# EAGLE schematic flash-programmer-v11 (EAGLE 6.4)
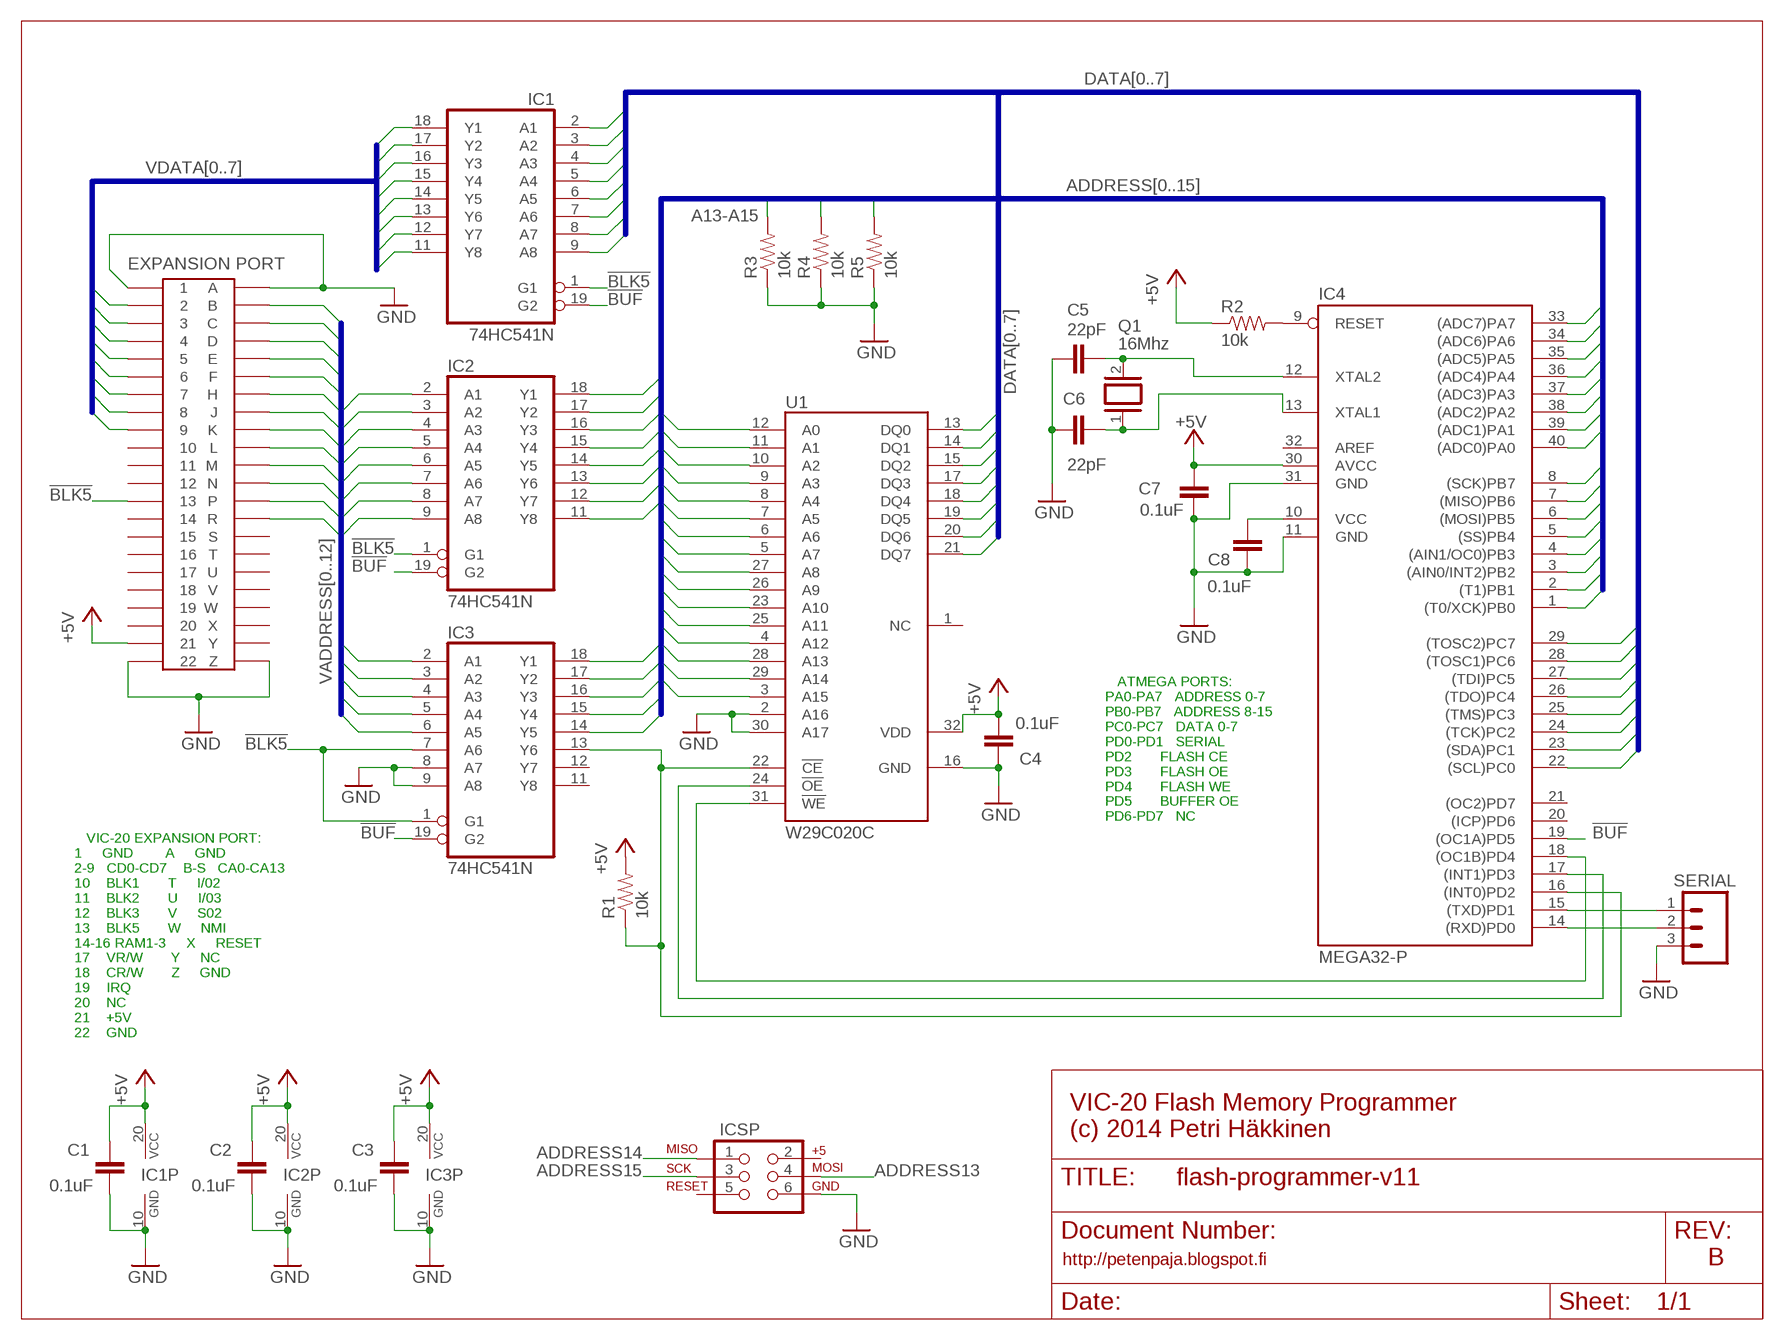
[diagram p0: schematic, sheet 1]

## Parts
C1  0.1uF  CAPPTH  [CAP-PTH-SMALL]
C2  0.1uF  CAPPTH  [CAP-PTH-SMALL]
C3  0.1uF  CAPPTH  [CAP-PTH-SMALL]
C4  0.1uF  CAPPTH  [CAP-PTH-SMALL]
C5  22pF  CAPPTH  [CAP-PTH-SMALL]
C6  22pF  CAPPTH  [CAP-PTH-SMALL]
C7  0.1uF  CAPPTH  [CAP-PTH-SMALL]
C8  0.1uF  CAPPTH  [CAP-PTH-SMALL]
IC1  74HC541N  [DIL20]
IC2  74HC541N  [DIL20]
IC3  74HC541N  [DIL20]
IC4  MEGA32-P  [DIL40]
ICSP  AVR_SPI_PRG_6PTH  [2X3]
P1  44PINEDGE  [44PINEDGE]
Q1  16Mhz  XTAL  [Q]
R1  10k  RESISTORPTH-1/4W  [AXIAL-0.4]
R2  10k  RESISTORPTH-1/4W  [AXIAL-0.4]
R3  10k  RESISTORPTH-1/4W  [AXIAL-0.4]
R4  10k  RESISTORPTH-1/4W  [AXIAL-0.4]
R5  10k  RESISTORPTH-1/4W  [AXIAL-0.4]
SERIAL  M03PTH  [1X03]
U1  W29C020C  [DIL32]

## Nets
!BLK5: IC1.1(G1) IC2.1(G1) IC3.1(G1) IC3.7(A6) P1.13
!BUF: IC1.19(G2) IC2.19(G2) IC3.19(G2) IC4.19((OC1A)PD5)
+5V: C1.1 C2.1 C3.1 C7.1 IC1.20(VCC) IC2.20(VCC) IC3.20(VCC) IC4.30(AVCC) R1.P$2
ADDRESS0: IC2.18(Y1) IC4.40((ADC0)PA0) U1.12(A0)
ADDRESS1: IC2.17(Y2) IC4.39((ADC1)PA1) U1.11(A1)
ADDRESS2: IC2.16(Y3) IC4.38((ADC2)PA2) U1.10(A2)
ADDRESS3: IC2.15(Y4) IC4.37((ADC3)PA3) U1.9(A3)
ADDRESS4: IC2.14(Y5) IC4.36((ADC4)PA4) U1.8(A4)
ADDRESS5: IC2.13(Y6) IC4.35((ADC5)PA5) U1.7(A5)
ADDRESS6: IC2.12(Y7) IC4.34((ADC6)PA6) U1.6(A6)
ADDRESS7: IC2.11(Y8) IC4.33((ADC7)PA7) U1.5(A7)
ADDRESS8: IC3.18(Y1) IC4.1((T0/XCK)PB0) U1.27(A8)
ADDRESS9: IC3.17(Y2) IC4.2((T1)PB1) U1.26(A9)
ADDRESS10: IC3.16(Y3) IC4.3((AIN0/INT2)PB2) U1.23(A10)
ADDRESS11: IC3.15(Y4) IC4.4((AIN1/OC0)PB3) U1.25(A11)
ADDRESS12: IC3.14(Y5) IC4.5((SS)PB4) U1.4(A12)
ADDRESS13: IC4.6((MOSI)PB5) ICSP.4 R3.P$2 U1.28(A13)
ADDRESS14: IC4.7((MISO)PB6) ICSP.1 R4.P$2 U1.29(A14)
ADDRESS15: IC4.8((SCK)PB7) ICSP.3 R5.P$2 U1.3(A15)
DATA0: IC1.2(A1) IC4.22((SCL)PC0) U1.13(DQ0)
DATA1: IC1.3(A2) IC4.23((SDA)PC1) U1.14(DQ1)
DATA2: IC1.4(A3) IC4.24((TCK)PC2) U1.15(DQ2)
DATA3: IC1.5(A4) IC4.25((TMS)PC3) U1.17(DQ3)
DATA4: IC1.6(A5) IC4.26((TDO)PC4) U1.18(DQ4)
DATA5: IC1.7(A6) IC4.27((TDI)PC5) U1.19(DQ5)
DATA6: IC1.8(A7) IC4.28((TOSC1)PC6) U1.20(DQ6)
DATA7: IC1.9(A8) IC4.29((TOSC2)PC7) U1.21(DQ7)
GND: C1.2 C2.2 C3.2 C4.1 C5.1 C6.1 C7.2 C8.1 IC1.10(GND) IC2.10(GND) IC3.8(A7) IC3.9(A8) IC3.10(GND) IC4.11(GND) IC4.31(GND) ICSP.6 P1.1 P1.22 P1.A P1.Z R3.P$1 R4.P$1 R5.P$1 SERIAL.3 U1.2(A16) U1.16(GND) U1.30(A17)
N$1: C5.2 IC4.12(XTAL2) Q1.2
N$2: C8.2 IC4.10(VCC)
N$3: IC4.9(RESET) R2.P$2
N$5: IC4.18((OC1B)PD4) U1.31(!WE)
N$6: IC4.15((TXD)PD1) SERIAL.1
N$7: IC4.17((INT1)PD3) U1.24(!OE)
N$8: IC3.13(Y6) IC4.16((INT0)PD2) R1.P$1 U1.22(!CE)
N$9: IC4.14((RXD)PD0) SERIAL.2
N$10: C6.2 IC4.13(XTAL1) Q1.1
VADDRESS0: IC2.2(A1) P1.B
VADDRESS1: IC2.3(A2) P1.C
VADDRESS2: IC2.4(A3) P1.D
VADDRESS3: IC2.5(A4) P1.E
VADDRESS4: IC2.6(A5) P1.F
VADDRESS5: IC2.7(A6) P1.H
VADDRESS6: IC2.8(A7) P1.J
VADDRESS7: IC2.9(A8) P1.K
VADDRESS8: IC3.2(A1) P1.L
VADDRESS9: IC3.3(A2) P1.M
VADDRESS10: IC3.4(A3) P1.N
VADDRESS11: IC3.5(A4) P1.P
VADDRESS12: IC3.6(A5) P1.R
VCC: C4.2 P1.21 R2.P$1 U1.32(VDD) ; supply symbol labelled +5V
VDATA0: IC1.18(Y1) P1.2
VDATA1: IC1.17(Y2) P1.3
VDATA2: IC1.16(Y3) P1.4
VDATA3: IC1.15(Y4) P1.5
VDATA4: IC1.14(Y5) P1.6
VDATA5: IC1.13(Y6) P1.7
VDATA6: IC1.12(Y7) P1.8
VDATA7: IC1.11(Y8) P1.9
Unconnected: IC3.11(Y8) IC3.12(Y7) IC4.20((ICP)PD6) IC4.21((OC2)PD7) IC4.32(AREF) ICSP.2 ICSP.5 P1.10 P1.11 P1.12 P1.14 P1.15 P1.16 P1.17 P1.18 P1.19 P1.20 P1.S P1.T P1.U P1.V P1.W P1.X P1.Y U1.1(NC)

## Buses
ADDRESS[0..15]
DATA[0..7]
VDATA[0..7]
VADDRESS[0..12]

## Notes on the sheet
- A13-A15
- EXPANSION PORT
- ATMEGA PORTS:
  PA0-PA7   ADDRESS 0-7
  PB0-PB7   ADDRESS 8-15
  PC0-PC7   DATA 0-7
  PD0-PD1   SERIAL
  PD2       FLASH CE
  PD3       FLASH OE
  PD4       FLASH WE
  PD5       BUFFER OE
  PD6-PD7   NC
- VIC-20 EXPANSION PORT:
  1     GND        A     GND
  2-9   CD0-CD7    B-S   CA0-CA13
  10    BLK1       T     I/02
  11    BLK2       U     I/03
  12    BLK3       V     S02
  13    BLK5       W     NMI
  14-16 RAM1-3     X     RESET
  17    VR/W       Y     NC
  18    CR/W       Z     GND
  19    IRQ
  20    NC
  21    +5V
  22    GND
- VIC-20 Flash Memory Programmer
  (c) 2014 Petri Häkkinen
- http://petenpaja.blogspot.fi | B

## Library data of the parts
C1-C8 = SparkFun-Capacitors:CAP: Capacitor Standard 0603 ceramic capacitor, and 0.1" leaded capacitor.
IC1-IC3 = 74xx-eu:74*541: Octal BUFFER and LINE DRIVER, 3-state
IC4 = atmel:MEGA32-P: MICROCONTROLLER 32 Kbytes FLASH 2 Kbytes SRAM 1 Kbytes EEPROM USART 8-channel 10 bit ADC Source: www.atmel.com .. doc2503.pdf; MPN: ATMEGA32-16PU; OC_FARNELL: 1661729; OC_NEWARK: 51P1794
ICSP = SparkFun-Connectors:AVR_SPI_PRG_6: AVR ISP 6 Pin This is the reduced ISP connector for AVR programming. Common on Arduino. This footprint will take up less PCB space and can be used with a 10-pin to 6-pin adapter such as SKU: BOB-08508
P1 = commodore:44PINEDGE: 44 PIN EDGE CONNECTOR FOR PCB
Q1 = special:XTAL: CRYSTAL
R1-R5 = SparkFun-Passives:RESISTOR: Resistor Basic schematic elements and footprints for 0603, 1206, and PTH resistors.
SERIAL = SparkFun-Connectors:M03: Header 3 Standard 3-pin 0.1" header. Use with straight break away headers (SKU : PRT-00116), right angle break away headers (PRT-00553), swiss pins (PRT-00743), machine pins (PRT-00117), and female headers (PRT-00115). Molex polarized connector foot print use with SKU : PRT-08232 with associated crimp pins and housings.
U1 = PetenPaja:W29C020C: 256K x 8 CMOS Flash Memory